# EAGLE schematic ROM-BANK_004 EAGLE 630 (EAGLE 6.3)
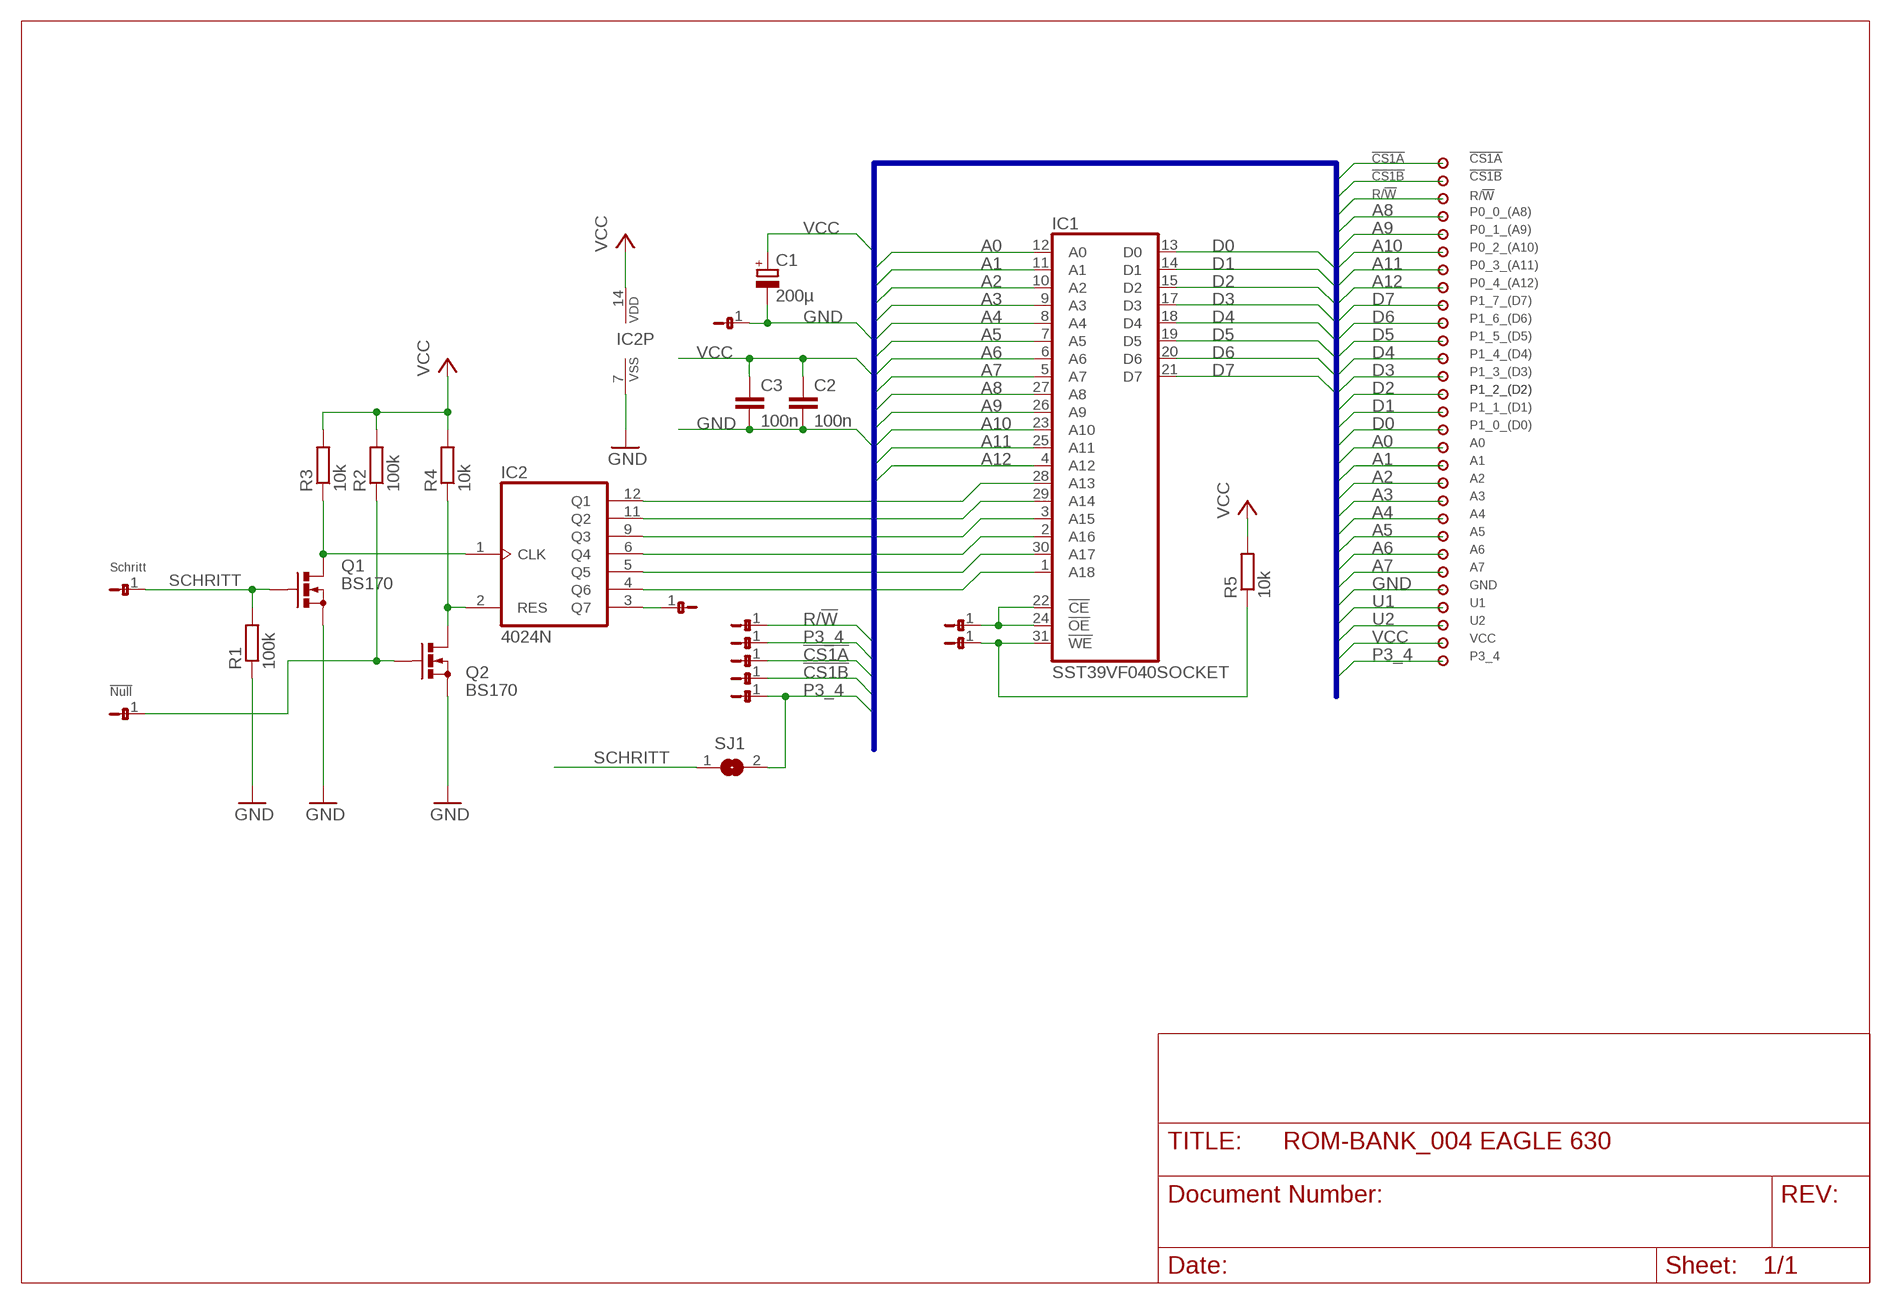
[diagram p0: schematic, sheet 1]

## Parts
!NULL  JP1-1JP1-1B  [JP1-1B]
C1  200µ  CPOL-EUE15-6AXIAL  [E15-6]
C2  100n  C-EU025-024X044  [C025-024X044]
C3  100n  C-EU025-024X044  [C025-024X044]
IC1  SST39VF040SOCKET  [PLCC-32-SOCKET]
IC2  4024N  [DIL14]
Q1  BS170  [SOT54E]
Q2  BS170  [SOT54E]
Q7  JP1-1JP1-1B  [JP1-1B]
R1  100k  R-EU_0207/10  [0207/10]
R2  100k  R-EU_0207/10  [0207/10]
R3  10k  R-EU_0207/10  [0207/10]
R4  10k  R-EU_0207/10  [0207/10]
R5  10k  R-EU_0207/10  [0207/10]
R/!W  JP1-1JP1-1B  [JP1-1B]
SCHRITT  JP1-1JP1-1B  [JP1-1B]
SJ1  SJ  [SJ]
U$1  BUS2929PUR  [BUS29_PUR]
U$2  JP1-1JP1-1B  [JP1-1B]
U$3  JP1-1JP1-1B  [JP1-1B]
U$4  JP1-1JP1-1B  [JP1-1B]
U$6  JP1-1JP1-1B  [JP1-1B]
U$8  JP1-1JP1-1B  [JP1-1B]
U$9  JP1-1JP1-1B  [JP1-1B]
U$10  JP1-1JP1-1B  [JP1-1B]

## Nets
!CE&OE: IC1.22(!CE) IC1.24(!OE) U$10.1
!CS1A: U$1.1.29 U$8.1
!CS1B: U$1.1.28 U$9.1
!NULL: !NULL.1 Q2.G R2.1
!WE: IC1.31(!WE) R5.1 U$4.1
A0: IC1.12(A0) U$1.1.13
A1: IC1.11(A1) U$1.1.12
A2: IC1.10(A2) U$1.1.11
A3: IC1.9(A3) U$1.1.10
A4: IC1.8(A4) U$1.1.9
A5: IC1.7(A5) U$1.1.8
A6: IC1.6(A6) U$1.1.7
A7: IC1.5(A7) U$1.1.6
A8: IC1.27(A8) U$1.1.26
A9: IC1.26(A9) U$1.1.25
A10: IC1.23(A10) U$1.1.24
A11: IC1.25(A11) U$1.1.23
A12: IC1.4(A12) U$1.1.22
D0: IC1.13(D0) U$1.1.14
D1: IC1.14(D1) U$1.1.15
D2: IC1.15(D2) U$1.1.16
D3: IC1.17(D3) U$1.1.17
D4: IC1.18(D4) U$1.1.18
D5: IC1.19(D5) U$1.1.19
D6: IC1.20(D6) U$1.1.20
D7: IC1.21(D7) U$1.1.21
GND: C1.- C2.2 C3.2 IC2.7(VSS) Q1.S Q2.S R1.1 U$1.1.5 U$2.1
N$1: IC1.28(A13) IC2.12(Q1)
N$2: IC1.29(A14) IC2.11(Q2)
N$3: IC1.3(A15) IC2.9(Q3)
N$4: IC1.2(A16) IC2.6(Q4)
N$5: IC1.30(A17) IC2.5(Q5)
N$6: IC1.1(A18) IC2.4(Q6)
N$7: IC2.2(RES) Q2.D R4.1
N$8: IC2.1(CLK) Q1.D R3.1
N$11: IC2.3(Q7) Q7.1
P3_4: SJ1.2 U$1.1.1 U$3.1 U$6.1
R/!W: R/!W.1 U$1.1.27
SCHRITT: Q1.G R1.2 SCHRITT.1 SJ1.1
U1: U$1.1.4
U2: U$1.1.3
VCC: C1.+ C2.1 C3.1 IC2.14(VDD) R2.2 R3.2 R4.2 R5.2 U$1.1.2

## Buses
BUS1:A[0..12],D[0..7],GND,U1,U2,VCC,P3_4,R/!W,!CS1B,!CS1A

## Notes on the sheet
- !CS1A
- !CS1B
- Schritt
- GND
- U1
- U2
- VCC
- P3_4
- !Null

## Power pins joined to a net without a drawn wire
GND: IC1.16(GND)
VCC: IC1.32(VCC)

## Library data of the parts
!NULL Q7 R/!W SCHRITT U$2-U$4 U$6 U$8-U$10 = NRF24L01_Radio:JP1-1
C1 = rcl:CPOL-EU: POLARIZED CAPACITOR, European symbol
C2 C3 = rcl:C-EU: CAPACITOR, European symbol
IC1 = memory:SST39VF040: 4 Mbit x8 Multi-Purpose Flash Source: http://www.sst.com/dotAsset/40782.pdf
IC2 = 40xx:4024: 7-stage binary/ripple COUNTER
Q1 Q2 = transistor-small-signal:BS170: N-CHANNEL MOS FET
R1-R5 = rcl:R-EU_: RESISTOR, European symbol
SJ1 = jumper:SJ: SMD solder JUMPER
U$1 = NRF24L01_Radio:BUS29